# Altium project KATADC_V1-3.PrjPCB (part 3 of 3)
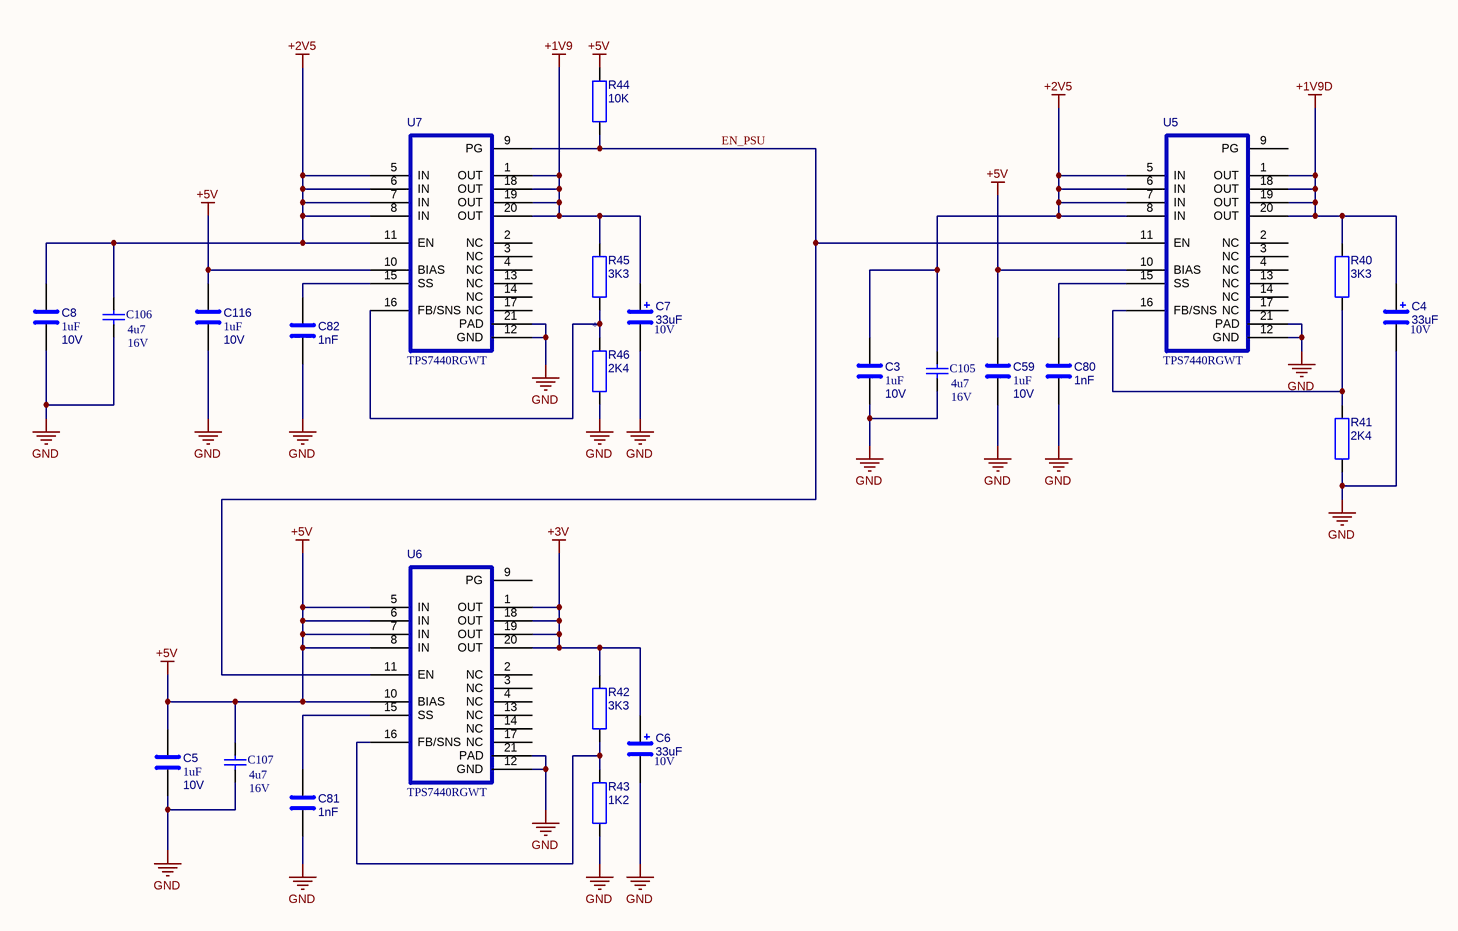
[diagram p12: ADC-POWER SUPPLY.SchDoc]

## Nets that join several sheets
+1V9: ADC-ADC (26 pins), ADC-POWER SUPPLY (6 pins)
+1V9D: ADC-LOGIC LEVEL CONVERTERS (8 pins), ADC-ADC (18 pins), ADC-POWER SUPPLY (6 pins)
+2V5: ADC-LOGIC LEVEL CONVERTERS (C28.2 C30.2 U22.5 U24.5), ADC-Peripherals (C38.2 R15.1 R16.1 U28.2), ADC-Z-DOK (C103.1 L5.1), ADC-POWER SUPPLY (13 pins)
+3V: ADC-ICHANNEL INPUT (C99.1 JP2.1 U30.1), ADC-ICHANNEL GAIN CONTROL (AT12.18 C16.1), ADC-LOGIC LEVEL CONVERTERS (C31.2 U23.5), ADC-Peripherals (7 pins), ADC-QCHANNEL INPUT (C100.1 JP3.1 U31.1), ADC-Q CHANNEL GAIN CONTROL (AT22.18 C60.1), ADC-SYNC INPUT (C79.2 U29.1), ADC-POWER SUPPLY (6 pins)
+5V: ADC-ICHANNEL GAIN CONTROL (C32.1 U10.1 U10.3), ADC-LOGIC LEVEL CONVERTERS (R12.1 R52.1), ADC-Peripherals (11 pins), ADC-Q CHANNEL GAIN CONTROL (C110.1 U36.1 U36.3), ADC-Z-DOK (C102.1 L4.2), ADC-POWER SUPPLY (12 pins)
GND: ADC-EXTERNAL CLOCK INPUT (J4.2 T3.3), ADC-ICHANNEL INPUT (7 pins), ADC-ICHANNEL GAIN CONTROL (22 pins), ADC-LOGIC LEVEL CONVERTERS (10 pins), ADC-Peripherals (21 pins), ADC-QCHANNEL INPUT (7 pins), ADC-Q CHANNEL GAIN CONTROL (22 pins), ADC-SYNC INPUT (C79.1 J6.2 R47.2 U29.2), ADC-Z-DOK (56 pins), ADC-ADC (45 pins), ADC-POWER SUPPLY (23 pins)
CAL_3: ADC-LOGIC LEVEL CONVERTERS (U23.1), ADC-Peripherals (U34.13)
CAL_19: ADC-LOGIC LEVEL CONVERTERS (R9.2 U23.6), ADC-ADC (U19.30)
CALRUN_5: ADC-LOGIC LEVEL CONVERTERS (R12.2 U21.6), ADC-Peripherals (U35.13)
CALRUN_19: ADC-LOGIC LEVEL CONVERTERS (U21.1), ADC-ADC (U19.126)
CH1: ADC-ICHANNEL INPUT (AT11.2), ADC-ICHANNEL GAIN CONTROL (C18.1)
CH1_DAD0: ADC-ICHANNEL GAIN CONTROL (AT12.24), ADC-Peripherals (U35.4)
CH1_DAD1: ADC-ICHANNEL GAIN CONTROL (AT12.23), ADC-Peripherals (U35.5)
CH1_DAD2: ADC-ICHANNEL GAIN CONTROL (AT12.22), ADC-Peripherals (U35.6)
CH1_DAD3: ADC-ICHANNEL GAIN CONTROL (AT12.21), ADC-Peripherals (U35.7)
CH1_DAD4: ADC-ICHANNEL GAIN CONTROL (AT12.20), ADC-Peripherals (U35.8)
CH1_DAD5: ADC-ICHANNEL GAIN CONTROL (AT12.19), ADC-Peripherals (U35.9)
CH1_DALE: ADC-ICHANNEL GAIN CONTROL (AT12.4 C19.1), ADC-Peripherals (U35.10)
CH1_TERM: ADC-ICHANNEL INPUT (JP2.2 U30.4), ADC-Peripherals (U35.11)
CH2: ADC-QCHANNEL INPUT (AT21.2), ADC-Q CHANNEL GAIN CONTROL (C61.1)
CH2_DAD0: ADC-Peripherals (U34.4), ADC-Q CHANNEL GAIN CONTROL (AT22.24)
CH2_DAD1: ADC-Peripherals (U34.5), ADC-Q CHANNEL GAIN CONTROL (AT22.23)
CH2_DAD2: ADC-Peripherals (U34.6), ADC-Q CHANNEL GAIN CONTROL (AT22.22)
CH2_DAD3: ADC-Peripherals (U34.7), ADC-Q CHANNEL GAIN CONTROL (AT22.21)
CH2_DAD4: ADC-Peripherals (U34.8), ADC-Q CHANNEL GAIN CONTROL (AT22.20)
CH2_DAD5: ADC-Peripherals (U34.9), ADC-Q CHANNEL GAIN CONTROL (AT22.19)
CH2_DALE: ADC-Peripherals (U34.10), ADC-Q CHANNEL GAIN CONTROL (AT22.4 C63.1)
CH2_TERM: ADC-Peripherals (U34.11), ADC-QCHANNEL INPUT (JP3.2 U31.4)
CLK+: ADC-EXTERNAL CLOCK INPUT (C55.2), ADC-ADC (U19.18)
CLK-: ADC-EXTERNAL CLOCK INPUT (C56.2), ADC-ADC (U19.19)
CS_ADC_19: ADC-LOGIC LEVEL CONVERTERS (R14.2 U24.6), ADC-ADC (U19.127)
CS_ADC_25: ADC-LOGIC LEVEL CONVERTERS (U24.1), ADC-Z-DOK (J1.F1)
DCLK+: ADC-Z-DOK (J1.C19), ADC-ADC (U19.82)
DCLK-: ADC-Z-DOK (J1.C20), ADC-ADC (U19.81)
DCLK_RST+: ADC-Z-DOK (J1.A11), ADC-ADC (U19.15)
DCLK_RST-: ADC-Z-DOK (J1.A12), ADC-ADC (U19.14)
DI0+: ADC-Z-DOK (J1.A7), ADC-ADC (U19.103)
DI0-: ADC-Z-DOK (J1.A8), ADC-ADC (U19.102)
DI1+: ADC-Z-DOK (J1.F7), ADC-ADC (U19.101)
DI1-: ADC-Z-DOK (J1.F8), ADC-ADC (U19.100)
DI2+: ADC-Z-DOK (J1.C7), ADC-ADC (U19.96)
DI2-: ADC-Z-DOK (J1.C8), ADC-ADC (U19.95)
DI3+: ADC-Z-DOK (J1.D9), ADC-ADC (U19.94)
DI3-: ADC-Z-DOK (J1.D10), ADC-ADC (U19.93)
DI4+: ADC-Z-DOK (J1.A9), ADC-ADC (U19.92)
DI4-: ADC-Z-DOK (J1.A10), ADC-ADC (U19.91)
DI5+: ADC-Z-DOK (J1.F9), ADC-ADC (U19.90)
DI5-: ADC-Z-DOK (J1.F10), ADC-ADC (U19.89)
DI6+: ADC-Z-DOK (J1.C9), ADC-ADC (U19.86)
DI6-: ADC-Z-DOK (J1.C10), ADC-ADC (U19.85)
DI7+: ADC-Z-DOK (J1.D11), ADC-ADC (U19.84)
DI7-: ADC-Z-DOK (J1.D12), ADC-ADC (U19.83)
DID0+: ADC-Z-DOK (J1.D3), ADC-ADC (U19.125)
DID0-: ADC-Z-DOK (J1.D4), ADC-ADC (U19.124)
DID1+: ADC-Z-DOK (J1.A3), ADC-ADC (U19.123)
DID1-: ADC-Z-DOK (J1.A4), ADC-ADC (U19.122)
DID2+: ADC-Z-DOK (J1.C3), ADC-ADC (U19.118)
DID2-: ADC-Z-DOK (J1.C4), ADC-ADC (U19.117)
DID3+: ADC-Z-DOK (J1.D5), ADC-ADC (U19.116)
DID3-: ADC-Z-DOK (J1.D6), ADC-ADC (U19.115)
DID4+: ADC-Z-DOK (J1.A5), ADC-ADC (U19.114)
DID4-: ADC-Z-DOK (J1.A6), ADC-ADC (U19.113)
DID5+: ADC-Z-DOK (J1.F5), ADC-ADC (U19.112)
DID5-: ADC-Z-DOK (J1.F6), ADC-ADC (U19.111)
DID6+: ADC-Z-DOK (J1.C5), ADC-ADC (U19.107)
DID6-: ADC-Z-DOK (J1.C6), ADC-ADC (U19.106)
DID7+: ADC-Z-DOK (J1.D7), ADC-ADC (U19.105)
DID7-: ADC-Z-DOK (J1.D8), ADC-ADC (U19.104)
DQ0+: ADC-Z-DOK (J1.A15), ADC-ADC (U19.58)
DQ0-: ADC-Z-DOK (J1.A16), ADC-ADC (U19.59)
DQ1+: ADC-Z-DOK (J1.D15), ADC-ADC (U19.60)
DQ1-: ADC-Z-DOK (J1.D16), ADC-ADC (U19.61)
DQ2+: ADC-Z-DOK (J1.C13), ADC-ADC (U19.65)
DQ2-: ADC-Z-DOK (J1.C14), ADC-ADC (U19.66)
DQ3+: ADC-Z-DOK (J1.F13), ADC-ADC (U19.67)
DQ3-: ADC-Z-DOK (J1.F14), ADC-ADC (U19.68)
DQ4+: ADC-Z-DOK (J1.A13), ADC-ADC (U19.69)
DQ4-: ADC-Z-DOK (J1.A14), ADC-ADC (U19.70)
DQ5+: ADC-Z-DOK (J1.D13), ADC-ADC (U19.71)
DQ5-: ADC-Z-DOK (J1.D14), ADC-ADC (U19.72)
DQ6+: ADC-Z-DOK (J1.C11), ADC-ADC (U19.75)
DQ6-: ADC-Z-DOK (J1.C12), ADC-ADC (U19.76)
DQ7+: ADC-Z-DOK (J1.F11), ADC-ADC (U19.77)
DQ7-: ADC-Z-DOK (J1.F12), ADC-ADC (U19.78)
DQD0+: ADC-Z-DOK (J1.A19), ADC-ADC (U19.36)
DQD0-: ADC-Z-DOK (J1.A20), ADC-ADC (U19.37)
DQD1+: ADC-Z-DOK (J1.D19), ADC-ADC (U19.38)
DQD1-: ADC-Z-DOK (J1.D20), ADC-ADC (U19.39)
DQD2+: ADC-Z-DOK (J1.C17), ADC-ADC (U19.43)
DQD2-: ADC-Z-DOK (J1.C18), ADC-ADC (U19.44)
DQD3+: ADC-Z-DOK (J1.F17), ADC-ADC (U19.45)
DQD3-: ADC-Z-DOK (J1.F18), ADC-ADC (U19.46)
DQD4+: ADC-Z-DOK (J1.A17), ADC-ADC (U19.47)
DQD4-: ADC-Z-DOK (J1.A18), ADC-ADC (U19.48)
DQD5+: ADC-Z-DOK (J1.D17), ADC-ADC (U19.49)
DQD5-: ADC-Z-DOK (J1.D18), ADC-ADC (U19.50)
DQD6+: ADC-Z-DOK (J1.C15), ADC-ADC (U19.54)
DQD6-: ADC-Z-DOK (J1.C16), ADC-ADC (U19.55)
DQD7+: ADC-Z-DOK (J1.F15), ADC-ADC (U19.56)
DQD7-: ADC-Z-DOK (J1.F16), ADC-ADC (U19.57)
I2C_SCL: ADC-Peripherals (P1.1 R16.2 U28.3), ADC-Z-DOK (J1.F2)
I2C_SDA: ADC-Peripherals (P1.3 R15.2 U28.4), ADC-Z-DOK (J1.D2)
OR+/DCLK2+: ADC-Z-DOK (J1.F19), ADC-ADC (U19.79)
OR-/DCLK2-: ADC-Z-DOK (J1.F20), ADC-ADC (U19.80)
PD_19: ADC-LOGIC LEVEL CONVERTERS (R13.2 U24.4), ADC-ADC (U19.26)
PD_25: ADC-LOGIC LEVEL CONVERTERS (U24.3), ADC-Z-DOK (J1.C1)
SER_CLK: ADC-LOGIC LEVEL CONVERTERS (U22.3), ADC-Z-DOK (J1.A1)
SER_CLK_19: ADC-LOGIC LEVEL CONVERTERS (R10.2 U22.4), ADC-ADC (U19.3)
SER_DATA: ADC-LOGIC LEVEL CONVERTERS (U22.1), ADC-Z-DOK (J1.D1)
SER_DATA_19: ADC-LOGIC LEVEL CONVERTERS (R11.2 U22.6), ADC-ADC (U19.4)
SYNC+: ADC-SYNC INPUT (U29.4), ADC-Z-DOK (J1.F3)
SYNC-: ADC-SYNC INPUT (U29.3), ADC-Z-DOK (J1.F4)
TDIODE_N: ADC-Peripherals (C33.2 R18.2), ADC-ADC (U19.35)
TDIODE_P: ADC-Peripherals (C33.1 R17.2), ADC-ADC (U19.34)
VIN_I+: ADC-ICHANNEL GAIN CONTROL (C24.2), ADC-ADC (U19.11)
VIN_I-: ADC-ICHANNEL GAIN CONTROL (C25.2), ADC-ADC (U19.10)
VIN_Q+: ADC-Q CHANNEL GAIN CONTROL (C62.2), ADC-ADC (U19.22)
VIN_Q-: ADC-Q CHANNEL GAIN CONTROL (C69.2), ADC-ADC (U19.23)